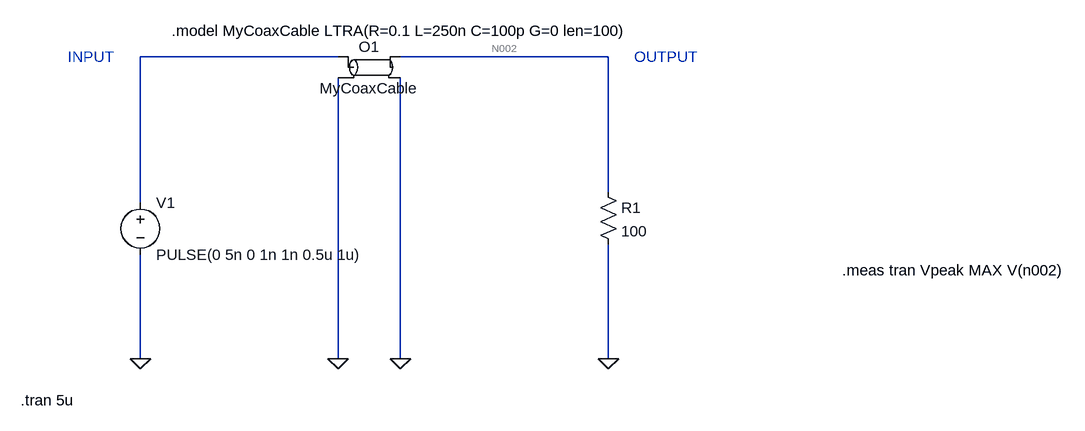
[diagram p0: schematic 100,200,300m.asc]
100,200,300m.asc, the LTspice schematic file:
Version 4.1
SHEET 1 1428 680
WIRE 288 -80 -16 -80
WIRE 704 -80 384 -80
WIRE 704 128 704 -80
WIRE -16 144 -16 -80
WIRE -16 384 -16 224
WIRE 288 384 288 -48
WIRE 384 384 384 -48
WIRE 704 384 704 208
FLAG -16 384 0
FLAG 288 384 0
FLAG 704 384 0
FLAG 384 384 0
SYMBOL voltage -16 128 R0
WINDOW 123 0 0 Left 0
WINDOW 39 0 0 Left 0
SYMATTR InstName V1
SYMATTR Value PULSE(0 5n 0 1n 1n 0.5u 1u)
SYMBOL ltline 336 -64 R0
SYMATTR InstName O1
SYMATTR Value MyCoaxCable
SYMBOL res 688 112 R0
SYMATTR InstName R1
SYMATTR Value 100
TEXT 32 -120 Left 2 !.model MyCoaxCable LTRA(R=0.1 L=250n C=100p G=0 len=100)
TEXT -128 -80 Left 2 ;INPUT
TEXT 744 -80 Left 2 ;OUTPUT
TEXT -200 448 Left 2 !.tran 5u
TEXT 1064 248 Left 2 !.meas tran Vpeak MAX V(n002)

The netlist it stands for:
* 100,200,300m.asc
V1 N001 0 PULSE(0 5n 0 1n 1n 0.5u 1u)
O1 N001 0 N002 0 MyCoaxCable
R1 N002 0 100
.model MyCoaxCable LTRA(R=0.1 L=250n C=100p G=0 len=100)
* INPUT
* OUTPUT
.tran 5u
.meas tran Vpeak MAX V(n002)
.backanno
.end